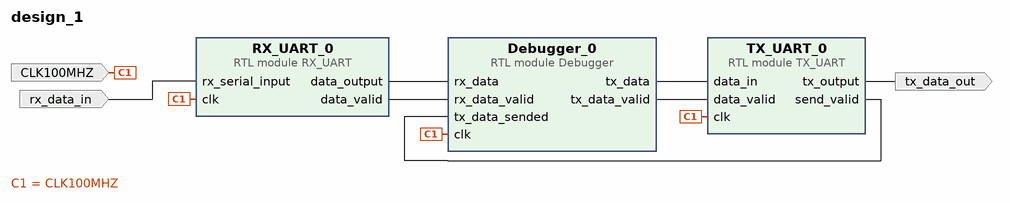
[diagram p0: block diagram of the top level]
# Vivado block design design_1, xc7a35ticsg324-1L, Vivado 2024.1
create_bd_design design_1

create_bd_port -dir I CLK100MHZ
create_bd_port -dir I rx_data_in
create_bd_port -dir O tx_data_out

create_bd_cell -type module -reference TX_UART TX_UART_0
create_bd_cell -type module -reference Debugger Debugger_0
create_bd_cell -type module -reference RX_UART RX_UART_0

# ---- connections ----

connect_bd_net [get_bd_ports CLK100MHZ] [get_bd_pins RX_UART_0/clk] [get_bd_pins TX_UART_0/clk] [get_bd_pins Debugger_0/clk]
connect_bd_net [get_bd_pins Debugger_0/tx_data] [get_bd_pins TX_UART_0/data_in]
connect_bd_net [get_bd_pins Debugger_0/tx_data_valid] [get_bd_pins TX_UART_0/data_valid]
connect_bd_net [get_bd_pins RX_UART_0/data_output] [get_bd_pins Debugger_0/rx_data]
connect_bd_net [get_bd_pins RX_UART_0/data_valid] [get_bd_pins Debugger_0/rx_data_valid]
connect_bd_net [get_bd_pins TX_UART_0/send_valid] [get_bd_pins Debugger_0/tx_data_sended]
connect_bd_net [get_bd_pins TX_UART_0/tx_output] [get_bd_ports tx_data_out]
connect_bd_net [get_bd_ports rx_data_in] [get_bd_pins RX_UART_0/rx_serial_input]

validate_bd_design
save_bd_design
